# Altium schematic sheet VGA.SchDoc
size A4
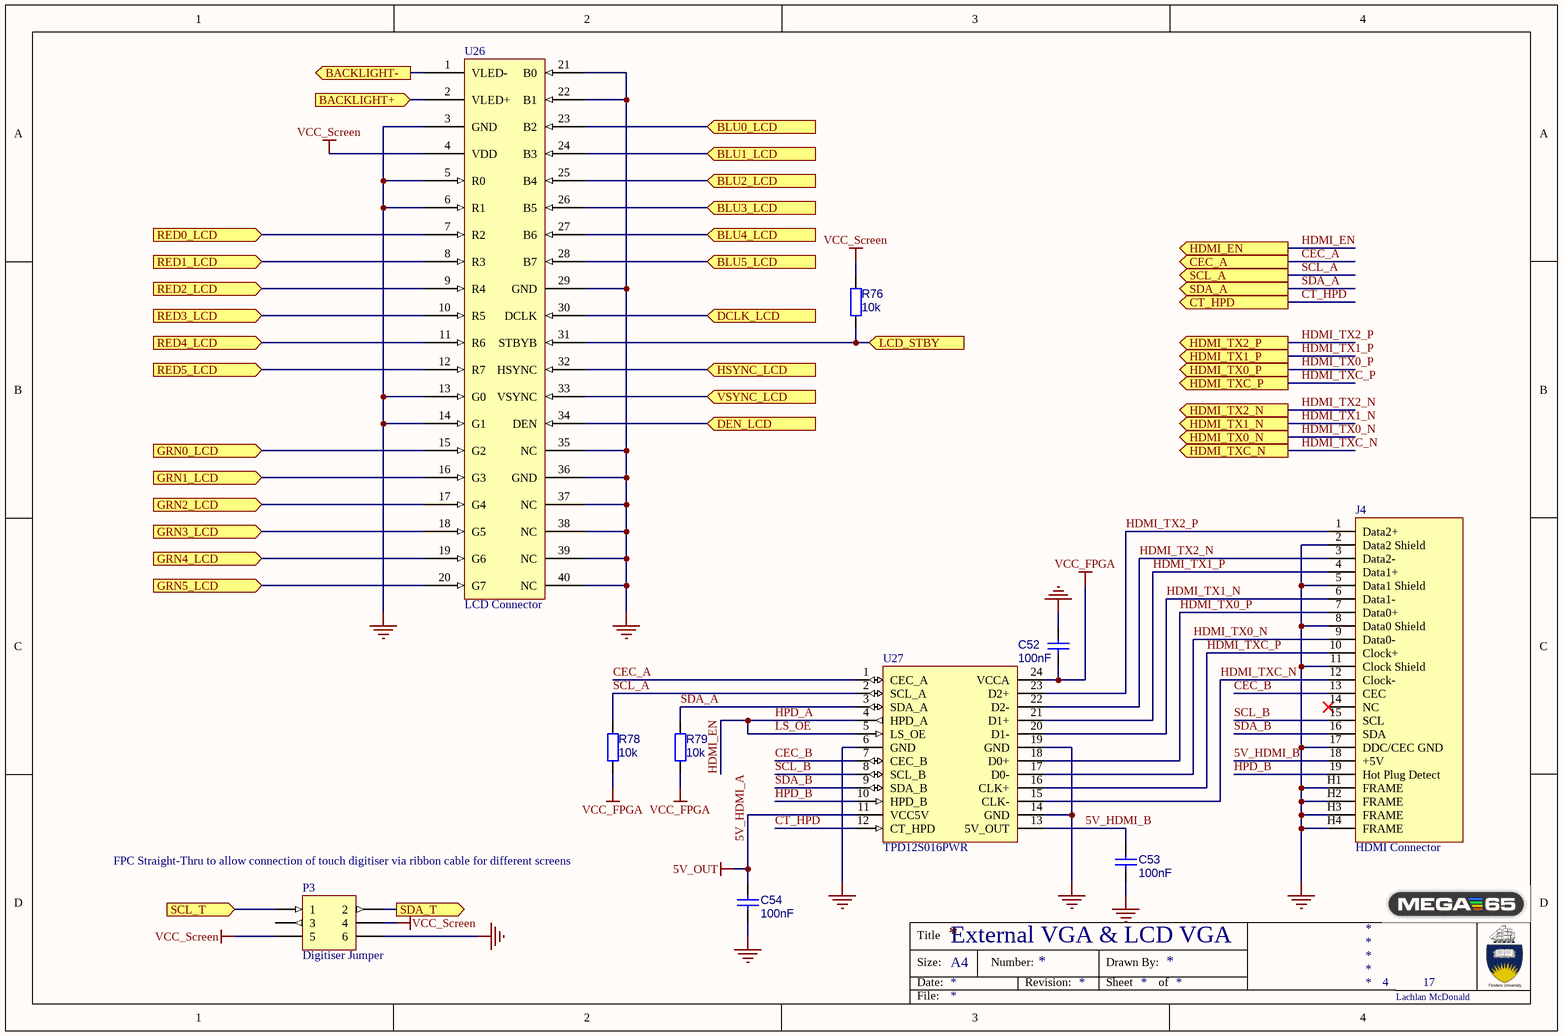
[diagram p0: VGA.SchDoc]

## Parts
C52  100nF  [0603_CAP UF HD]
C53  100nF  [0603_CAP UF HD]
C54  100nF  [0603_CAP UF HD]
J4  HDMI Connector  [A35071TR-ND]
P3  Digitiser Jumper  [CONNECTOR FPC MOLEX 51281-0694]
R76  10k  [0603-RESISTOR HD]
R78  10k  [0603-RESISTOR HD]
R79  10k  [0603-RESISTOR HD]
U26  LCD Connector  [Connector FPC 40 pin TE 4-1734839-0]
U27  TPD12S016PWR  [SOP65P640X120-24N]

## Ports
BACKLIGHT+ (in), BACKLIGHT- (out), BLU0_LCD (in), BLU1_LCD (in), BLU2_LCD (in), BLU3_LCD (in), BLU4_LCD (in), BLU5_LCD (in), CEC_A (out), CT_HPD (out), DCLK_LCD (in), DEN_LCD (in), GRN0_LCD (in), GRN1_LCD (in), GRN2_LCD (in), GRN3_LCD (in), GRN4_LCD (in), GRN5_LCD (in), HDMI_EN (out), HDMI_TX0_N (out), HDMI_TX0_P (out), HDMI_TX1_N (out), HDMI_TX1_P (out), HDMI_TX2_N (out), HDMI_TX2_P (out), HDMI_TXC_N (out), HDMI_TXC_P (out), HSYNC_LCD (in), LCD_STBY (in), RED0_LCD (in), RED1_LCD (in), RED2_LCD (in), RED3_LCD (in), RED4_LCD (in), RED5_LCD (in), SCL_A (out), SCL_T (in), SDA_A (out), SDA_T (out), VSYNC_LCD (in)

## Nets
5V_HDMI_A: C54.1 U27.11(VCC5V)  [also labelled 5V_OUT]
GND: C52.1 C53.2 C54.2 J4.2(Data2_Shield) J4.5(Data1_Shield) J4.8(Data0_Shield) J4.11(Clock_Shield) J4.17(DDC/CEC_GND) J4.H1(FRAME) J4.H2(FRAME) J4.H3(FRAME) J4.H4(FRAME) P3.6 U26.3(GND) U26.5(R0) U26.6(R1) U26.13(G0) U26.14(G1) U26.21(B0) U26.22(B1) U26.29(GND) U26.35(NC) U26.36(GND) U26.37(NC) U26.38(NC) U26.39(NC) U26.40(NC) U27.6(GND) U27.14(GND) U27.19(GND)
VCC_FPGA: C52.2 R78.2 R79.2 U27.24(VCCA)
VCC_Screen: P3.4 P3.5 R76.1 U26.4(VDD)
5V_HDMI_B: C53.1 J4.18(+5V) U27.13(5V_OUT)
BACKLIGHT+: U26.2(VLED+) ; port BACKLIGHT+
BACKLIGHT-: U26.1(VLED-) ; port BACKLIGHT-
BLU0_LCD: U26.23(B2) ; port BLU0_LCD
BLU1_LCD: U26.24(B3) ; port BLU1_LCD
BLU2_LCD: U26.25(B4) ; port BLU2_LCD
BLU3_LCD: U26.26(B5) ; port BLU3_LCD
BLU4_LCD: U26.27(B6) ; port BLU4_LCD
BLU5_LCD: U26.28(B7) ; port BLU5_LCD
CEC_A: U27.1(CEC_A) ; port CEC_A
CEC_B: J4.13(CEC) U27.7(CEC_B)
CT_HPD: U27.12(CT_HPD) ; port CT_HPD
DCLK_LCD: U26.30(DCLK) ; port DCLK_LCD
DEN_LCD: U26.34(DEN) ; port DEN_LCD
GRN0_LCD: U26.15(G2) ; port GRN0_LCD
GRN1_LCD: U26.16(G3) ; port GRN1_LCD
GRN2_LCD: U26.17(G4) ; port GRN2_LCD
GRN3_LCD: U26.18(G5) ; port GRN3_LCD
GRN4_LCD: U26.19(G6) ; port GRN4_LCD
GRN5_LCD: U26.20(G7) ; port GRN5_LCD
HDMI_EN: U27.4(HPD_A) U27.5(LS_OE) ; port HDMI_EN  [also labelled HPD_A, LS_OE]
HDMI_TX0_N: J4.9(Data0-) U27.17(D0-) ; port HDMI_TX0_N
HDMI_TX0_P: J4.7(Data0+) U27.18(D0+) ; port HDMI_TX0_P
HDMI_TX1_N: J4.6(Data1-) U27.20(D1-) ; port HDMI_TX1_N
HDMI_TX1_P: J4.4(Data1+) U27.21(D1+) ; port HDMI_TX1_P
HDMI_TX2_N: J4.3(Data2-) U27.22(D2-) ; port HDMI_TX2_N
HDMI_TX2_P: J4.1(Data2+) U27.23(D2+) ; port HDMI_TX2_P
HDMI_TXC_N: J4.12(Clock-) U27.15(CLK-) ; port HDMI_TXC_N
HDMI_TXC_P: J4.10(Clock+) U27.16(CLK+) ; port HDMI_TXC_P
HPD_B: J4.19(Hot_Plug_Detect) U27.10(HPD_B)
HSYNC_LCD: U26.32(HSYNC) ; port HSYNC_LCD
LCD_STBY: R76.2 U26.31(STBYB) ; port LCD_STBY
RED0_LCD: U26.7(R2) ; port RED0_LCD
RED1_LCD: U26.8(R3) ; port RED1_LCD
RED2_LCD: U26.9(R4) ; port RED2_LCD
RED3_LCD: U26.10(R5) ; port RED3_LCD
RED4_LCD: U26.11(R6) ; port RED4_LCD
RED5_LCD: U26.12(R7) ; port RED5_LCD
SCL_A: R78.1 U27.2(SCL_A) ; port SCL_A
SCL_B: J4.15(SCL) U27.8(SCL_B)
SCL_T: P3.1 ; port SCL_T
SDA_A: R79.1 U27.3(SDA_A) ; port SDA_A
SDA_B: J4.16(SDA) U27.9(SDA_B)
SDA_T: P3.2 ; port SDA_T
VSYNC_LCD: U26.33(VSYNC) ; port VSYNC_LCD

Not connected (* = marked no-connect by the designer): J4 14(NC)*; P3 3

## Notes on the sheet
- FPC Straight-Thru to allow connection of touch digitiser via ribbon cable for different screens
- External VGA & LCD VGA
- 4
- 17
- Lachlan McDonald
- Title
- Size:
- Date:
- A4
- Number:
- Revision:
- Sheet
- Drawn By:
- of
- File:

## Library data of the parts
C52-C54 = Cap: Capacitor; Value: 100nF
J4 = HDMI: HDMI Buchse 19Pol. 90°; AN: 26642; Trenz-Stock: Yes; Mixed: SMT; H-ART: 685119134923; Temperature-Range: -25/+85; Extra: WE685119134923; Case: HDMI; HelpURL: B:\AD\adlib\datasheet\685119134923
P3 = Header 3X2: Header, 3-Pin, Dual row; Manufacturer: Hirose; Manufacturer Number: FH12-6S-0.5SH(55); Element 14 Part Number: 1324538; Digikey Number: HFJ106CT-ND
R76 R78 R79 = Resistor: Value: 10k
U26 = LCD Connector: Manufacturer: Hirose; Manufacturer Number: FH12A-40S-0.5SH(55); Element 14 Part Number: 1324569; Digikey Number: HFK140CT-ND
U27 = TPD12S016PWR: AN: 25112; Trenz-Stock: Yes; Mixed: SMT; Extra: HDMI Companion Chip with I2C Level Shifting Buffer, 12 Channel ESD; Case: TSSOP24; HelpURL: B:\AD\adlib\datasheet\TPD12S016; H-ART: TPD12S016PWR